# EasyEDA Pro project RealisticPM_2026-10-08.epro, board ug_m3
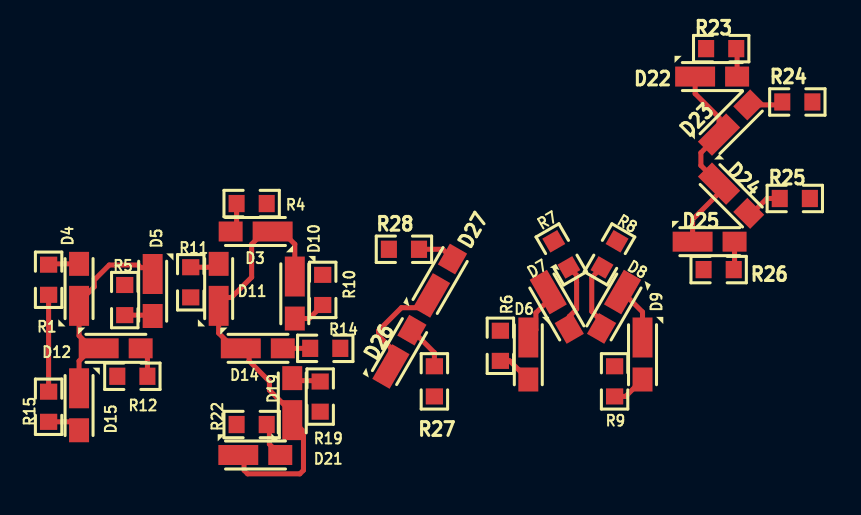
[diagram p12: board, top side]
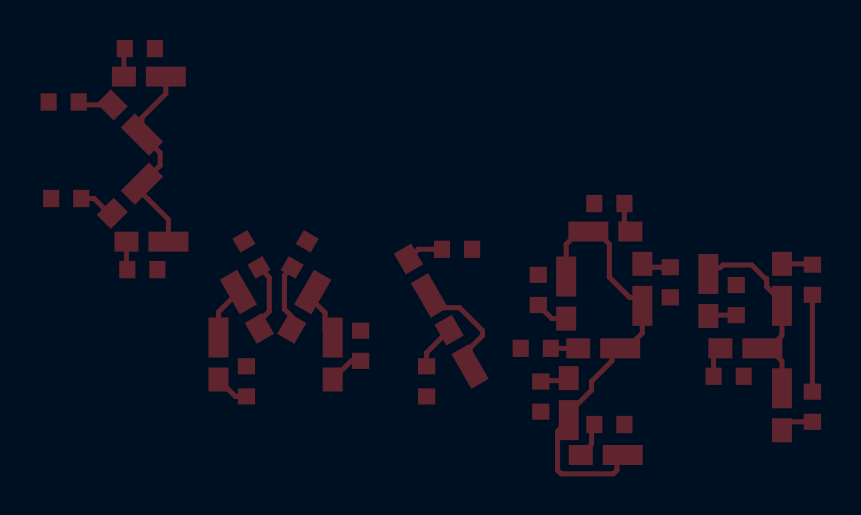
[diagram p13: board, bottom side, seen from below]

No outline. copper layers: Top Layer, Bottom Layer. Coordinates in mm from the lowest, leftmost part position.
Stack: Top Layer 0.035mm / Dielectric1 1.51mm FR4 er 4.5 / Bottom Layer 0.035mm

## Design rules (mm)
spacing copperThickness1oz (default): track to track 0.102, other pairs 0.152 to 0.3
spacing copperThickness2oz: track to track 0.203, other pairs 0.152 to 0.3
spacing Plane_innerPlane: track to track 0.102, other pairs 0.152 to 0.3
spacing Copper_copperRegion: track to track 0.102, other pairs 0.152 to 0.3
track width copperThickness1oz (default): min 0.127, default 0.254, max 2.54
track width copperThickness2oz: min 0.203, default 0.254, max 2.54
differential pair differentialPair (default): width min 0.127, default 0.254, max 2.54; gap min 0.152, default 0.152

## Placement (name value [footprint] x y rotation side)
D3  GW JCLPS2.CM-GVH3-A131-1-65-2-R33  [LED-SMD_L3.0-W1.4-RD]  10.16 11.18 180 top
D4  GW JCLPS2.CM-GVH3-A131-1-65-2-R33  [LED-SMD_L3.0-W1.4-RD]  1.52 8.51 90 top
D5  GW JCLPS2.CM-GVH3-A131-1-65-2-R33  [LED-SMD_L3.0-W1.4-RD]  5.21 8 270 top
D6  GW JCLPS2.CM-GVH3-A131-1-65-2-R33  [LED-SMD_L3.0-W1.4-RD]  24 4.83 270 top
D7  GW JCLPS2.CM-GVH3-A131-1-65-2-R33  [LED-SMD_L3.0-W1.4-RD]  25.53 7.24 300 top
D8  GW JCLPS2.CM-GVH3-A131-1-65-2-R33  [LED-SMD_L3.0-W1.4-RD]  28.19 7.24 240 top
D9  GW JCLPS2.CM-GVH3-A131-1-65-2-R33  [LED-SMD_L3.0-W1.4-RD]  29.72 4.83 270 top
D10  GW JCLPS2.CM-GVH3-A131-1-65-2-R33  [LED-SMD_L3.0-W1.4-RD]  12.32 7.87 270 top
D11  GW JCLPS2.CM-GVH3-A131-1-65-2-R33  [LED-SMD_L3.0-W1.4-RD]  8.51 8.51 90 top
D12  GW JCLPS2.CM-GVH3-A131-1-65-2-R33  [LED-SMD_L3.0-W1.4-RD]  3.56 5.33 0 top
D14  GW JCLPS2.CM-GVH3-A131-1-65-2-R33  [LED-SMD_L3.0-W1.4-RD]  10.67 5.33 0 top
D15  GW JCLPS2.CM-GVH3-A131-1-65-2-R33  [LED-SMD_L3.0-W1.4-RD]  1.52 2.29 270 top
D19  GW JCLPS2.CM-GVH3-A131-1-65-2-R33  [LED-SMD_L3.0-W1.4-RD]  12.19 2.79 90 top
D21  GW JCLPS2.CM-GVH3-A131-1-65-2-R33  [LED-SMD_L3.0-W1.4-RD]  10.54 0 0 top
D22  GW JCLPS2.CM-GVH3-A131-1-65-2-R33  [LED-SMD_L3.0-W1.4-RD]  33.4 18.92 0 top
D23  GW JCLPS2.CM-GVH3-A131-1-65-2-R33  [LED-SMD_L3.0-W1.4-RD]  34.29 16.76 45 top
D24  GW JCLPS2.CM-GVH3-A131-1-65-2-R33  [LED-SMD_L3.0-W1.4-RD]  34.29 12.83 315 top
D25  GW JCLPS2.CM-GVH3-A131-1-65-2-R33  [LED-SMD_L3.0-W1.4-RD]  33.27 10.67 0 top
D26  GW JCLPS2.CM-GVH3-A131-1-65-2-R33  [LED-SMD_L3.0-W1.4-RD]  17.65 5.33 60 top
D27  GW JCLPS2.CM-GVH3-A131-1-65-2-R33  [LED-SMD_L3.0-W1.4-RD]  19.69 8.89 60 top
R1  330Ω  [R0603]  0 8.76 90 top
R4  330Ω  [R0603]  10.16 12.57 180 top
R5  330Ω  [R0603]  3.81 7.75 90 top
R6  330Ω  [R0603]  22.61 5.46 270 top
R7  330Ω  [R0603]  25.65 10.03 120 top
R8  330Ω  [R0603]  28.07 10.03 60 top
R9  330Ω  [R0603]  28.32 3.68 270 top
R10  330Ω  [R0603]  13.72 8.25 90 top
R11  330Ω  [R0603]  7.11 8.64 270 top
R12  330Ω  [R0603]  4.19 3.94 0 top
R14  330Ω  [R0603]  13.84 5.33 180 top
R15  330Ω  [R0603]  0 2.41 270 top
R19  330Ω  [R0603]  13.59 2.92 90 top
R22  330Ω  [R0603]  10.16 1.52 0 top
R23  330Ω  [R0603]  33.66 20.32 0 top
R24  330Ω  [R0603]  37.47 17.65 0 top
R25  330Ω  [R0603]  37.34 12.83 0 top
R26  330Ω  [R0603]  33.53 9.27 0 top
R27  330Ω  [R0603]  19.3 3.68 90 top
R28  330Ω  [R0603]  17.78 10.29 0 top

## Footprints (pads in the part's own frame, mm; a bottom-side part is the same pattern mirrored in y, then rotated)
LED-SMD_L3.0-W1.4-RD
  rect 2x1 smd: 1(-1.05,0)
  rect 1.2x1 smd: 2(1.05,0)
R0603
  rect 0.806x0.864 smd: 1(-0.753,0) 2(0.753,0)

## Nets
As in the schematic.

## Routing (per net, layer and track width the routed paths; a pad name or vN(x,y) marks a point on that pad's centre or on a via; arc(x,y) is an arc through that point)
VCC: length 4.8
  Top Layer w0.254: R1.1 R15.1
REG: length 53.3
  Top Layer w0.254: D21.1 9.78,-0.29 9.78,-0.76 9.96,-0.94 12.57,-0.94 12.75,-0.76 12.75,1.18 D19.1 12.19,2.1 11.05,3.25 11.05,3.68 10.03,4.7 10.03,4.92 D14.1 9.27,5.33 8.51,6.1 D11.1 8.92,7.87 9.14,7.87 10.16,8.89 10.16,10.54 10.8,11.18 11.68,11.18 12.32,10.54 D10.1 ; 2.16,5.33 D12.1 ; 2.16,5.33 1.52,4.7 D15.1 ; 2.16,5.33 1.52,5.97 D4.1 1.52,7.65 2.29,8.41 2.29,8.83 2.36,8.83 3.03,9.5 4.48,9.5 4.62,9.37 4.95,9.37 5.21,9.11 D5.1 ; D7.1 25,7.73 24.38,7.11 24.38,6.26 D6.1 ; 32.22,10.67 32.22,11.78 33.55,13.1 D24.1 32.64,14.48 32.64,15.11 D23.1 33.55,16.87 32.35,18.07 D22.1 ; 19.16,7.98 18.55,7.37 17.65,7.37 16.51,6.22 16.51,5.97 17.13,5.35 D26.1 ; D9.1 29.72,7.15 D8.1
$1N510: length 1.5
  Top Layer w0.254: D12.2 4.94,5 R12.2
$1N514: length 1.5
  Top Layer w0.254: D4.2 0.04,9.56 R1.2
$1N518: length 1.7
  Top Layer w0.254: D15.2 1.1,1.66 R15.2
$1N522: length 1.4
  Top Layer w0.254: D5.2 5.16,6.99 R5.1
$1N974: length 3.4
  Top Layer w0.254: D7.2 26.05,6.93 26.42,7.29 26.42,8.63 26.42,8.64 26.42,9 R7.1
$1N989: length 1.8
  Top Layer w0.254: R6.2 23.07,4.71 D6.2
$1N1114: length 3.5
  Top Layer w0.254: D8.2 27.67,6.69 27.18,7.18 27.18,8.88 27.68,9.38 R8.1
$1N1215: length 1.7
  Top Layer w0.254: D9.2 28.87,2.93 R9.2
$1N1705: length 1.7
  Top Layer w0.254: R10.1 13.04,6.82 D10.2
$1N2547: length 1.5
  Top Layer w0.254: D3.2 9.41,11.47 R4.2
$1N2548: length 1.6
  Top Layer w0.254: D14.2 13.34,5.33
$1N2550: length 1.5
  Top Layer w0.254: R11.1 8.34,9.39 D11.2
$1N2558: length 1.4
  Top Layer w0.254: 12.19,3.72 13.55,3.72 R19.2
$1N2559: length 1.8
  Top Layer w0.254: R22.2 11.05,1.39 11.05,0.54 D21.2
$1N16102: length 1.4
  Top Layer w0.254: R23.2 34.45,20.28 D22.2
$1N16104: length 1.7
  Top Layer w0.254: D23.2 36.57,17.51 R24.1
$1N16105: length 1.9
  Top Layer w0.254: D24.2 35.2,12.08 35.94,12.83 R25.1
$1N16107: length 1.4
  Top Layer w0.254: R26.2 34.32,9.31 D25.2
$1N16193: length 2.3
  Top Layer w0.254: R27.2 19.3,5.12 D26.2
$1N16306: length 1.9
  Top Layer w0.254: D27.2 19.72,10.29 R28.2
